# Altium schematic sheet TPL-transceiver.SchDoc
size A3; DocumentNumber: 4; SheetNumber: 4; SheetTotal: 5; SheetDescription: TPL Transceiver
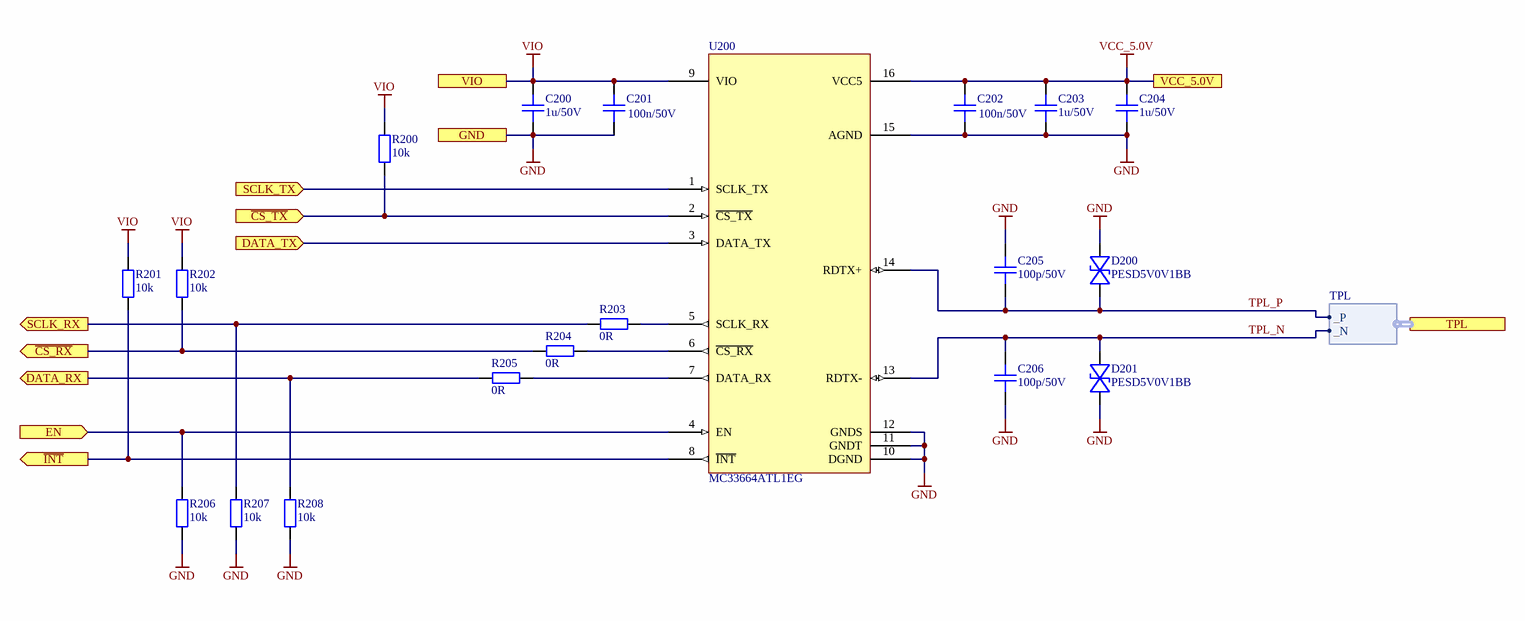
[diagram p0: TPL-transceiver.SchDoc]

## Parts
C200  1u/50V  [CAPC2012X14N]
C201  100n/50V  [CAPC1608X08N]
C202  100n/50V  [CAPC1608X08N]
C203  1u/50V  [CAPC2012X14N]
C204  1u/50V  [CAPC2012X14N]
C205  100p/50V  [CAPC1608X08N]
C206  100p/50V  [CAPC1608X08N]
D200  PESD5V0V1BB  [SOD523_PESD_NEXPERIA]
D201  PESD5V0V1BB  [SOD523_PESD_NEXPERIA]
R200  10k  [RESC1608X05N]
R201  10k  [RESC1608X05N]
R202  10k  [RESC1608X05N]
R203  0R  [RESC1608X05N]
R204  0R  [RESC1608X05N]
R205  0R  [RESC1608X05N]
R206  10k  [RESC1608X05N]
R207  10k  [RESC1608X05N]
R208  10k  [RESC1608X05N]
U200  MC33664ATL1EG  [MC33664ATL1EG]

## Ports
DATA_RX (out), DATA_TX (in), EN (in), GND, SCLK_RX (out), SCLK_TX (in), TPL (harness TPL), VCC_5.0V, VIO, ~{CS_RX} (out), ~{CS_TX} (in), ~{INT} (out)

## Harnesses
TPL: _P, _N

## Nets
GND: C200.1 C201.1 C202.1 C203.1 C204.1 C205.2 C206.1 D200.1(C) D201.2(A) R206.1 R207.1 R208.1 U200.10(DGND) U200.11(GNDT) U200.12(GNDS) U200.15(AGND) ; port GND
VCC_5.0V: C202.2 C203.2 C204.2 U200.16(VCC5) ; port VCC_5.0V
VIO: C200.2 C201.2 R200.2 R201.2 R202.2 U200.9(VIO) ; port VIO
~{CS_RX}: R202.1 R204.1 ; port ~{CS_RX}
~{CS_TX}: R200.1 U200.2(~{CS_TX}) ; port ~{CS_TX}
~{INT}: R201.1 U200.8(~{INT}) ; port ~{INT}
DATA_RX: R205.1 R208.2 ; port DATA_RX
DATA_TX: U200.3(DATA_TX) ; port DATA_TX
EN: R206.2 U200.4(EN) ; port EN
SCLK_RX: R203.1 R207.2 ; port SCLK_RX
SCLK_TX: U200.1(SCLK_TX) ; port SCLK_TX
TPL_N: C206.2 D201.1(C) U200.13(RDTX-) ; port TPL._N
TPL_P: C205.1 D200.2(A) U200.14(RDTX+) ; port TPL._P
NetR203_2: R203.2 U200.5(SCLK_RX)
NetR204_2: R204.2 U200.6(~{CS_RX})
NetR205_2: R205.2 U200.7(DATA_RX)

## Notes on the sheet
- Fraunhofer IISB
- Schottkystr. 10
- developed by:
- 91058 Erlangen
- Germany
- Author
- Project
- License
- Description
- File
- Version
- Release Date
- Sheet
- foxbms.org <https://foxbms.org>
- www.iisb.fraunhofer.de <https://www.iisb.fraunhofer.de/>
- foxBMS Team
- /

## Library data of the parts
C200 C203 C204 = gen_C_ceramic_1u_50V_X7R_0805: MLCC; Capacitance: 1u; Rated Voltage: 50V; Dielectric: X7R; Tolerance: ± 10%; Case EIA: 0805; Case Metric: 2012; AVT Set: x; Automotive Qualified: True; Part Number: gen_C_ceramic_1u_50V_X7R_0805; Operating Temperature: -55°C - +125°C; Supplier 1: Farnell; Supplier Part Number 1: 2672199; Supplier 2: Farnell; Supplier Part Number 2: 2479894; Supplier 3: Farnell; Supplier Part Number 3: 2464630
C201 C202 = gen_C_ceramic_100n_50V_X7R_0603: MLCC; Capacitance: 100n; Rated Voltage: 50V; Dielectric: X7R; Case EIA: 0603; Case Metric: 1608; PnP Package: 0603C; PnP Value: 100nF/50V/X7R; PnP equipped: x; Automotive Qualified: True; AEC-Q Norm: AEC-Q200; Part Number: gen_C_ceramic_100n_50V_X7R_0603; Supplier 1: Farnell; Supplier Part Number 1: 2525267; ECCN: EAR99; Supplier 2: Digikey; Supplier Part Number 2: 490-6049-1-ND
C205 C206 = gen_C_ceramic_100p_50V_C0G_0603: MLCC; Capacitance: 100p; Rated Voltage: 50V; Dielectric: C0G; Tolerance: ± 10%; Case EIA: 0603; Case Metric: 1608; PnP Package: 0603C; PnP Value: 100pF/50V/NP0; PnP equipped: x; Automotive Qualified: True; AEC-Q Norm: AEC-Q200; Part Number: gen_C_ceramic_100p_50V_C0G_0603; Supplier 1: Farnell; Supplier Part Number 1: 2478236; ECCN: EAR99
D200 D201 = PESD5V0V1BB: Very low capacitance bidirectional ESD protection diode; Manufacturer: Nexperia; Breakdown Voltage: 6.8V; PnP Package: SOD523; Automotive Qualified: True; AEC-Q Norm: AEC-Q101; Part Number: PESD5V0V1BB; Part Name: PESD5V0V1BB; Operating Temperature: -55°C - +150°C; Continuous Forward Current: *; ComponentLink1Description: Datasheet; ComponentLink1URL: https://assets.nexperia.com/documents/data-sheet/PESD5V0V1BB.pdf; Supplier 1: Mouser; Supplier Part Number 1: 771-PESD5V0V1BB115; Supplier 2: Digikey; Supplier Part Number 2: 1727-5808-1-ND; Supplier 3: Farnell; Supplier Part Number 3: 2069367; ECCN: EAR99
R200-R202 R206-R208 = gen_R_10k_0603: SMD Resistor 10k 0603; Tolerance: 1%; Power: 0.1W; Case EIA: 0603; Case Metric: 1608; Maximum Working Voltage: 75V; PnP Package: 0603R; Automotive Qualified: True; PnP equipped: x; Part Number: gen_R_10k_0603; Operating Temperature: -55°C - +155°C; Resistance: 10k; Series: E24, E96; PnP Value: 10k; Supplier 1: Farnell; Supplier Part Number 1: 2073349
R203-R205 = gen_R_0R_0603: SMD Resistor 0R 0603; Power: 0.1W; Case EIA: 0603; Case Metric: 1608; Maximum Working Voltage: 75V; PnP Package: 0603R; PnP equipped: x; Automotive Qualified: True; Part Number: gen_R_0R_0603; Operating Temperature: -55°C - +155°C; Resistance: 0R; Series: Jumper; PnP Value: 0R; Supplier 1: Farnell; Supplier Part Number 1: 2616580
U200 = MC33664ATL1EG: Isolated network high-speed transceiver; Manufacturer: NXP; PnP Package: SOT109-5; Automotive Qualified: True; Part Number: MC33664ATL1EG; Part Name: MC33664ATL1EG; Operating Temperature: -40°C - +125°C; ComponentLink1Description: Datasheet; ComponentLink1URL: https://www.nxp.com/docs/en/data-sheet/MC33664_SDS.pdf; Supplier 1: Mouser; Supplier Part Number 1: 841-MC33664ATL1EG; Supplier 2: Digikey; Supplier Part Number 2: 568-13893-ND / 568-13893-ND; Supplier 3: Farnell; Supplier Part Number 3: 2890308; ECCN: EAR99